# Altium schematic sheet 接收端、发射端.SchDoc
size A4
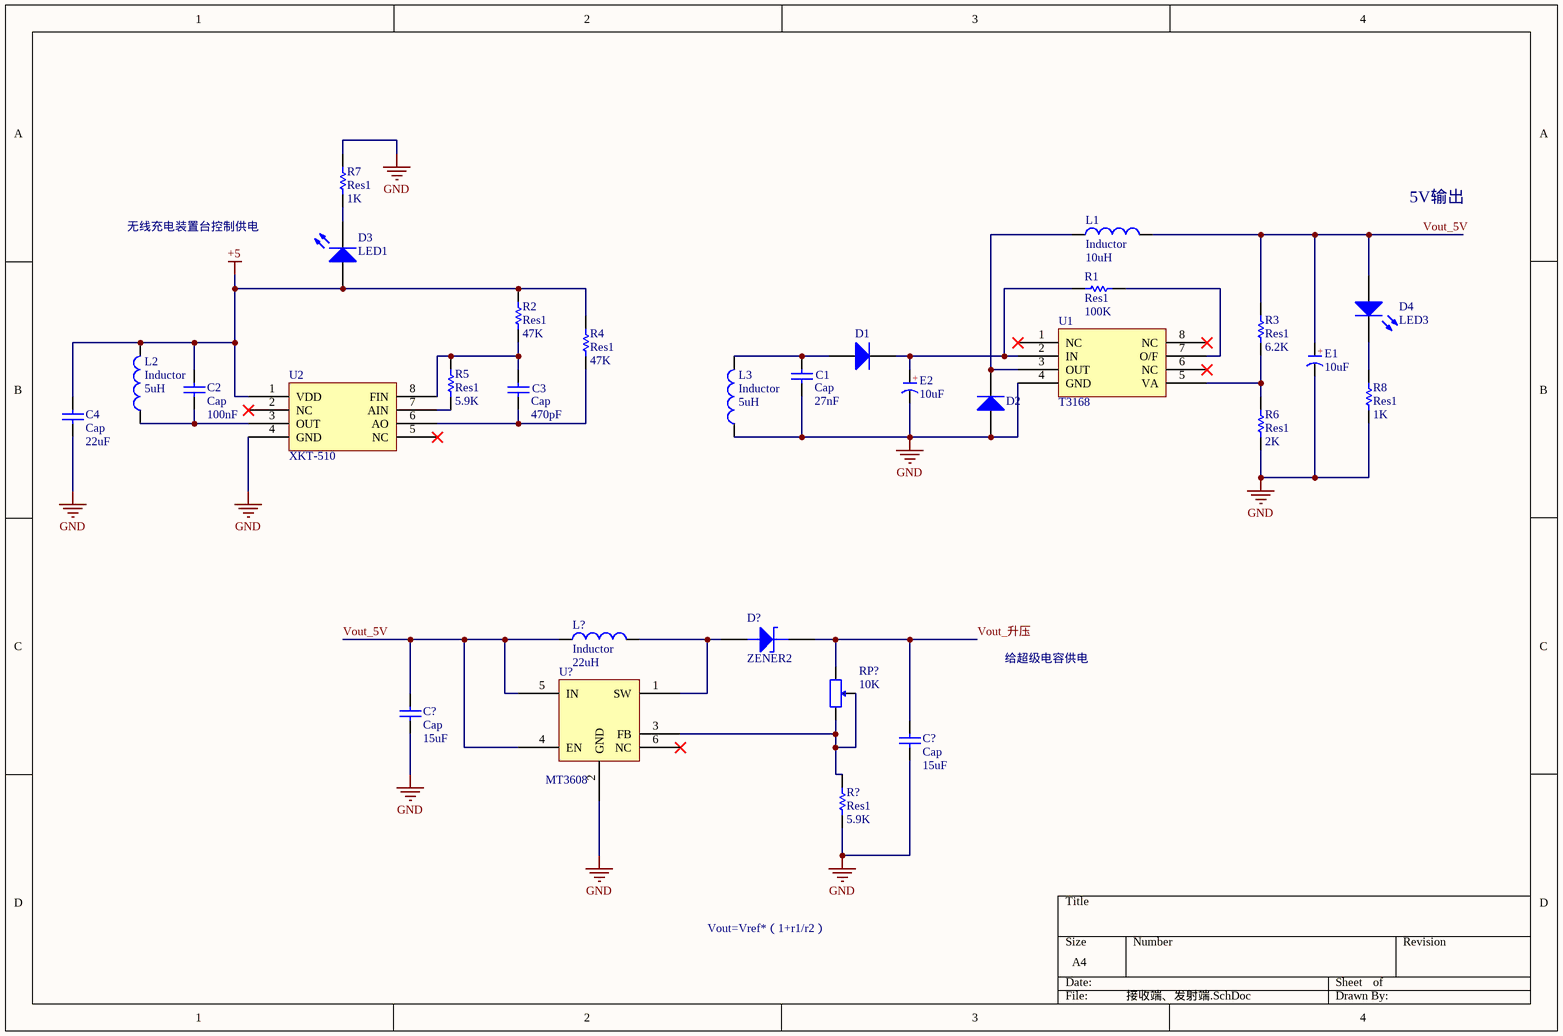
[diagram p0: 接收端、发射端.SchDoc]

## Parts
(Parts that share a designator on the sheet are numbered #1, #2 ... from top to bottom, then left to right.)
C1  Cap  value 27nF  [RAD-0.3]
C2  Cap  value 100nF  [RAD-0.3]
C3  Cap  value 470pF  [RAD-0.3]
C4  Cap  value 22uF  [RAD-0.3]
C?#1  Cap  value 15uF  [RAD-0.3]
C?#2  Cap  value 15uF  [RAD-0.3]
D1  (no value)  [SMA(DO-214AC)_S1]
D2  (no value)  [SMA(DO-214AC)_S1]
D3  LED1  [LED-1]
D4  LED3  [3.5X2.8X1.9]
D?  ZENER2
E1  10uF  [CAP 1.5*4*8]
E2  10uF  [CAP 1.5*4*8]
L1  Inductor  value 10uH  [0402-A]
L2  Inductor  value 5uH  [0402-A]
L3  Inductor  value 5uH  [0402-A]
L?  Inductor  value 22uH  [0402-A]
R1  Res1  value 100K  [AXIAL-0.3]
R2  Res1  value 47K  [AXIAL-0.3]
R3  Res1  value 6.2K  [AXIAL-0.3]
R4  Res1  value 47K  [AXIAL-0.3]
R5  Res1  value 5.9K  [AXIAL-0.3]
R6  Res1  value 2K  [AXIAL-0.3]
R7  Res1  value 1K  [AXIAL-0.3]
R8  Res1  value 1K  [AXIAL-0.3]
R?  Res1  value 5.9K  [AXIAL-0.3]
RP?  10K  [3296W]
U1  T3168
U2  XKT-510
U?  MT3608

## Nets
+5: C2.2 C4.2 D3.1(A) L2.2 R2.2 R4.2 U2.1(VDD)
GND: C1.1 C4.1 C?#1.2 C?#2.2 D2.1(A) E1.2(K) E2.2(K) L3.1 R6.1 R7.2 R8.1 R?.1 U1.4(GND) U2.4(GND) U?.2(GND)
Vout_5V: C?#1.1 D4.1(A) E1.1(A) L1.2 L?.1 R3.2 U?.4(EN) U?.5(IN)
Vout_升压: C?#2.1 D?.2(K) RP?.1
NetC1_2: C1.2 D1.1(A) L3.2
NetC2_1: C2.1 L2.1 U2.3(OUT)
NetC3_1: C3.1 R4.1 U2.6(AO)
NetC3_2: C3.2 R2.1 R5.2 U2.8(FIN)
NetD1_2: D1.2(K) E2.1(A) R1.2 U1.2(IN)
NetD2_2: D2.2(K) L1.1 U1.3(OUT)
NetD3_2: D3.2(K) R7.1
NetD4_2: D4.2(K) R8.2
NetD?_1: D?.1(A) L?.2 U?.1(SW)
NetR1_1: R1.1 U1.7(O/F)
NetR3_1: R3.1 R6.2 U1.5(VA)
NetR5_1: R5.1 U2.7(AIN)
NetR?_2: R?.2 RP?.2 RP?.3 U?.3(FB)

Not connected (* = marked no-connect by the designer): U1 1(NC)* 6(NC)* 8(NC)*; U2 2(NC)* 5(NC)*; U? 6(NC)*

## Notes on the sheet
- 无线充电装置台控制供电
- 5V输出
- 给超级电容供电
- Vout=Vref*（1+r1/r2）
- (in symbol C-CAP) +

## Library data of the parts
C1-C4 C?#1 C?#2 = Cap: Capacitor; Published: 8-Jun-2000; LatestRevisionDate: 17-Jul-2002; LatestRevisionNote: Re-released for DXP Platform.; PackageReference: RAD-0.3; Publisher: Altium Limited; PackageDescription: Radial Cap, Thru-Hole; 2 Leads; 0.3 in Pin Spacing
D1 D2 = SMA(DO-214AC) M7: 二极管; Notepad: 1N4007 4007 编号C2464 已经停售, 使用新物料编号C95872; ComponentLink1Description: 供应商链接; ComponentLink1URL: http://www.szlcsc.com/product/details_2841.html; Package: SMA(DO-214AC); Supplier: LC; SuppliersPartNumber: C95872
D3 = LED1: Typical RED GaAs LED; Published: 8-Jun-2000; LatestRevisionDate: 08-Jul-2005; LatestRevisionNote: Mech Layer 1 removed.; PackageReference: LED-1; Publisher: Altium Limited; PackageDescription: LED; 2 Leads
D4 = LED3: Typical BLUE SiC LED; Published: 8-Jun-2000; LatestRevisionDate: 17-Dec-2003; LatestRevisionNote: PCB Footprint replaced.; DatasheetVersion: 16-Apr-2002; PackageVersion: 16-Apr-2002; PackageReference: 3.5X2.8X1.9; Publisher: Altium Limited; PackageDescription: SM LED; 2 C-Bend Leads; Body 3.5 x 2.8 x 1.9 mm, inc leads (LxWxH typ)
D? = ZENER2: Zener Diode
E1 E2 = C-CAP: 直插电解电容; 版权归属: 源创客; BOM名称: 直插电解电容; 学习资源: www.ooocke.com
L1-L3 L? = Inductor: Code_IEC: 1005; Published: 8-Jun-2000; LatestRevisionDate: 29-May-2009; LatestRevisionNote: IPC-7351 Footprint Added.; PackageReference: 0402-A; Publisher: Altium Limited; PackageDescription: Chip Inductor; Code_JEITA: 0402
R1-R8 R? = Res1: Resistor; Published: 8-Jun-2000; LatestRevisionDate: 17-Jul-2002; LatestRevisionNote: Re-released for DXP Platform.; PackageReference: AXIAL-0.3; Publisher: Altium Limited; PackageDescription: Axial Device, Thru-Hole; 2 Leads; 0.3 in Pin Spacing
RP? = RP-ID: 插件单联电位器; BOM名称: 插件电位器; 版权归属: 源创客; 学习资源: www.ooocke.com
U1 = T3168 接受端
U2 =  XKT-510 发射端
U? = MT3608 升压